# Altium schematic sheet I_DC_Buffering_DIFF.SchDoc
size A4
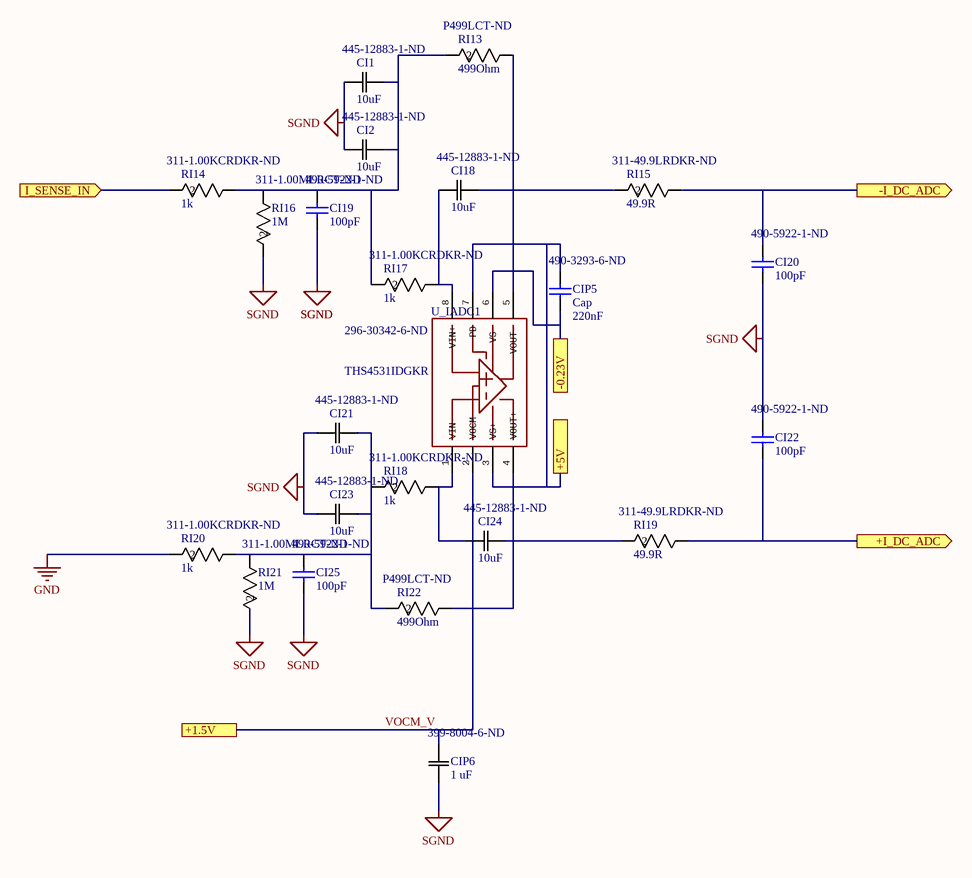
[diagram p0: I_DC_Buffering_DIFF.SchDoc]

## Parts
CI1  10uF  Supplier Part Number 1: 445-12883-1-ND  [CAP_3216]
CI2  10uF  Supplier Part Number 1: 445-12883-1-ND  [CAP_3216]
CI18  10uF  Supplier Part Number 1: 445-12883-1-ND  [CAP_3216]
CI19  Supplier Part Number 1: 490-5922-1-ND  [G-155]  (hidden comment: 100pF)
CI20  Supplier Part Number 1: 490-5922-1-ND  [G-155]  (hidden comment: 100pF)
CI21  10uF  Supplier Part Number 1: 445-12883-1-ND  [CAP_3216]
CI22  Supplier Part Number 1: 490-5922-1-ND  [G-155]  (hidden comment: 100pF)
CI23  10uF  Supplier Part Number 1: 445-12883-1-ND  [CAP_3216]
CI24  10uF  Supplier Part Number 1: 445-12883-1-ND  [CAP_3216]
CI25  Supplier Part Number 1: 490-5922-1-ND  [G-155]  (hidden comment: 100pF)
CIP5  Cap  value 220nF  Supplier Part Number 1: 490-3293-6-ND  [G-188]
CIP6  1 uF  Supplier Part Number 1: 399-8004-6-ND  [CAP_C0805]
RI13  499Ohm  Supplier Part Number 1: P499LCT-ND  [RC0402N]
RI14  1k  Supplier Part Number 1: 311-1.00KCRDKR-ND  [RC0805N]
RI15  49.9R  Supplier Part Number 1: 311-49.9LRDKR-ND  [RC0402N]
RI16  1M  Supplier Part Number 1: 311-1.00MLRCT-ND  [RC0402N]
RI17  1k  Supplier Part Number 1: 311-1.00KCRDKR-ND  [RC0805N]
RI18  1k  Supplier Part Number 1: 311-1.00KCRDKR-ND  [RC0805N]
RI19  49.9R  Supplier Part Number 1: 311-49.9LRDKR-ND  [RC0402N]
RI20  1k  Supplier Part Number 1: 311-1.00KCRDKR-ND  [RC0805N]
RI21  1M  Supplier Part Number 1: 311-1.00MLRCT-ND  [RC0402N]
RI22  499Ohm  Supplier Part Number 1: P499LCT-ND  [RC0402N]
U_IADC1  Supplier Part Number 1: 296-30342-6-ND  [DGK8]  (hidden comment: THS4531IDGKR)

## Ports
+1.5V, +5V, +I_DC_ADC (out), -0.23V, -I_DC_ADC (out), I_SENSE_IN (in)

## Nets
GND: RI20.2
SGND: CI1.1 CI2.1 CI19.1 CI20.1 CI21.1 CI22.2 CI23.1 CI25.1 CIP6.1 RI16.2 RI21.2
+5V: CIP5.2 U_IADC1.3(VS+) U_IADC1.7(PD) ; port +5V
+I_DC_ADC: CI22.1 RI19.1 ; port +I_DC_ADC
-0.23V: CIP5.1 U_IADC1.6(VS-) ; port -0.23V
-I_DC_ADC: CI20.2 RI15.1 ; port -I_DC_ADC
I_SENSE_IN: RI14.2 ; port I_SENSE_IN
VOCM_V: CIP6.2 U_IADC1.2(VOCM) ; port +1.5V
NetCI1_2: CI1.2 CI2.2 CI19.2 RI13.2 RI14.1 RI16.1 RI17.2
NetCI18_1: CI18.1 RI17.1 U_IADC1.8(VIN+)
NetCI18_2: CI18.2 RI13.1 RI15.2 U_IADC1.5(VOUT-)
NetCI21_2: CI21.2 CI23.2 CI25.2 RI18.2 RI20.1 RI21.1 RI22.2
NetCI24_1: CI24.1 RI18.1 U_IADC1.1(VIN-)
NetCI24_2: CI24.2 RI19.2 RI22.1 U_IADC1.4(VOUT+)

## Library data of the parts
CI1 CI2 CI18 CI21 CI23 CI24 = C3216JB1H106K160: No Description Available; Manufacturer_Part_Number: C3216JB1H106K160AB; Manufacturer Part Number: CGA5L3X5R1H106M160AB; Vendor: TDK; Built_By: EMA_UL_Team; Tolerance: 20%; Voltage Rating: 50V; Dielectric: X5R; Copyright: Copyright (C) 2018 Accelerated Designs. All rights reserved; RefDes: RefDes; Type: DEV; Value: Value; Supplier 1: Digi-Key; Manufacturer: TDK; Stock 1: 63212; Pricing 1: 1=0.88, 10=0.673, 100=0.4813, 500=0.3726, 1000=0.32085 (USD); Mount: Surface Mount; Case/Package: 1206; Weight: 0.000571oz; Case Code (Metric): 3216; Case Code (Imperial): 1206; Min Operating Temperature: -55°C; Max Operating Temperature: 85°C; Package Quantity: 2000; Packaging: Tape and Reel; Capacitance: 10uF; Termination: SMD/SMT; Voltage Rating (DC): 50V; Length: 0.126inch; Height: 1.6mm; Width: 0.063inch; Thickness: 0.071inch; Ratings: AEC-Q200; Lead Free: Lead Free; ComponentLink1URL: http://product.tdk.com/en/catalog/datasheets/mlcc_automotive_general_en.pdf?src-supplier=Avnet; ComponentLink1Description: http://product.tdk.com/en/catalog/datasheets/mlcc_automotive_general_en.pdf?src-supplier=Avnet; ComponentLink2URL: https://product.tdk.com/info/en/documents/chara_sheet/CGA5L3X5R1H106M160AB.pdf?src-supplier=Digi-Key; ComponentLink2Description: https://product.tdk.com/info/en/documents/chara_sheet/CGA5L3X5R1H106M160AB.pdf?src-supplier=Digi-Key; ComponentLink3URL: http://www.mouser.com/ds/2/400/lcc_automotive_general_en-843974.pdf?src-supplier=Mouser; ComponentLink3Description: http://www.mouser.com/ds/2/400/lcc_automotive_general_en-843974.pdf?src-supplier=Mouser
CI19 CI20 CI22 CI25 = 1004001100017: CAP,100PF,+/-5%,C0G,50V,SMD0402; Manufacturer: MURATA; Manufacturer Part Number: GRM1555C1H101JA01D; Rating: 5%; Embest PN: 1004001100017; Value: 100pF; Part Type: Ceramic Capacitor; Supplier 1: Digi-Key; Stock 1: 6730695; Pricing 1: 1=0.1, 10=0.035, 100=0.0157, 500=0.01124, 1000=0.00883, 2500=0.00802, 5000=0.00738 (USD); Mount: Surface Mount; Case/Package: 0402; Case Code (Metric): 1005; Case Code (Imperial): 0402; Material: Ceramic; Min Operating Temperature: -55°C; Max Operating Temperature: 125°C; Capacitance: 100pF; Dielectric: C0G; Tolerance: 5%; Voltage Rating: 50V; Packaging: Tape and Reel; Package Quantity: 1; Voltage Rating (DC): 50V; Termination: SMD/SMT; Voltage: 50V; Length: 1mm; Height: 0.5mm; Width: 0.02inch; Thickness: 0.022inch; Depth: 0.5mm; Radiation Hardening: No; REACH SVHC: No SVHC; Lead Free: Lead Free; ComponentLink1URL: http://uk.rs-online.com/webdocs/1423/0900766b81423dc4.pdf?src-supplier=RSComponents; ComponentLink1Description: http://uk.rs-online.com/webdocs/1423/0900766b81423dc4.pdf?src-supplier=RSComponents; ComponentLink2URL: http://psearch.murata.com/capacitor/product/GRM1555C1H101JA01%23.pdf?src-supplier=Future+Electronics; ComponentLink2Description: http://psearch.murata.com/capacitor/product/GRM1555C1H101JA01%23.pdf?src-supplier=Future+Electronics; ComponentLink3URL: https://www.murata.com/~/media/webrenewal/support/library/catalog/products/capacitor/mlcc/c02e.ashx?la=en-us&src-supplier=Digi-Key; ComponentLink3Description: https://www.murata.com/~/media/webrenewal/support/library/catalog/products/capacitor/mlcc/c02e.ashx?la=en-us&src-supplier=Digi-Key; ComponentLink4URL: https://www.verical.com/server-webapp/html/getDatasheet?partID=199957&src-supplier=Verical; ComponentLink4Description: https://www.verical.com/server-webapp/html/getDatasheet?partID=199957&src-supplier=Verical; ComponentLink5URL: https://produktinfo.conrad.com/datenblaetter/450000-474999/453557-da-01-en-VS_KONDENSATOR_0402.pdf?src-supplier=Conrad; ComponentLink5Description: https://produktinfo.conrad.com/datenblaetter/450000-474999/453557-da-01-en-VS_KONDENSATOR_0402.pdf?src-supplier=Conrad
CIP5 = Cap: Capacitor; Manufacturer: Murata; Manufacturer Part Number: GRM188R71C224KA01D; Tolerance: 10%; Voltage Rating: 16V; Dielectric: X7R; Published: 8-Jun-2000; LatestRevisionDate: 17-Jul-2002; LatestRevisionNote: Re-released for DXP Platform.; PackageReference: RAD-0.3; Publisher: Altium Limited; PackageDescription: Radial Cap, Thru-Hole; 2 Leads; 0.3 in Pin Spacing; Supplier 1: Digi-Key; Stock 1: 363677; Pricing 1: 1=0.17, 10=0.116, 100=0.0586, 500=0.04006, 1000=0.03544 (USD); Mount: Surface Mount; Case/Package: 0603; Number of Pins: 2; Case Code (Metric): 1608; Case Code (Imperial): 0603; Min Operating Temperature: -55°C; Max Operating Temperature: 125°C; Packaging: Tape and Reel; Capacitance: 220nF; Package Quantity: 1; Voltage Rating (DC): 16V; Termination: SMD/SMT; Voltage: 16V; Length: 1.6mm; Height: 0.8mm; Width: 0.031inch; Thickness: 0.035inch; Depth: 0.8mm; Radiation Hardening: No; REACH SVHC: No SVHC; Lead Free: Lead Free; ComponentLink1URL: https://www.murata.com/~/media/webrenewal/support/library/catalog/products/capacitor/mlcc/c02e.ashx?la=en-us&src-supplier=Digi-Key; ComponentLink1Description: https://www.murata.com/~/media/webrenewal/support/library/catalog/products/capacitor/mlcc/c02e.ashx?la=en-us&src-supplier=Digi-Key; ComponentLink2URL: http://www.farnell.com/datasheets/608985.pdf?src-supplier=Element14; ComponentLink2Description: http://www.farnell.com/datasheets/608985.pdf?src-supplier=Element14; ComponentLink3URL: http://www.farnell.com/datasheets/2048707.pdf?src-supplier=Element14; ComponentLink3Description: http://www.farnell.com/datasheets/2048707.pdf?src-supplier=Element14; ComponentLink4URL: http://psearch.murata.com/capacitor/product/GRM188R71C223KA01%23.pdf?src-supplier=Future+Electronics; ComponentLink4Description: http://psearch.murata.com/capacitor/product/GRM188R71C223KA01%23.pdf?src-supplier=Future+Electronics; ComponentLink5URL: http://www.farnell.com/datasheets/2048707.pdf?src-supplier=Verical; ComponentLink5Description: http://www.farnell.com/datasheets/2048707.pdf?src-supplier=Verical
CIP6 = C0805C105K3RACTU: No Description Available; Vendor: KEMET; Built_By: EMA_UL_Team; Dielectric Material: Ceramic; Capacitance: 1uF; Tolerance: 10%; Dielectric: X7R; Voltage: 25V; Manufacturer_Part_Number: C0805C105K3RACTU; Copyright: Copyright (C) 2018 Accelerated Designs. All rights reserved; RefDes: RefDes; Type: DEV; Value: Value; Supplier 1: Digi-Key; Manufacturer: KEMET; Manufacturer Part Number: C0805C105K3RACTU; Stock 1: 422784; Pricing 1: 1=0.15, 10=0.105, 100=0.0495, 500=0.03472, 1000=0.02875 (USD); Mount: Surface Mount; Case/Package: 0805; Number of Pins: 2; Contact Plating: Tin,Matte; Case Code (Imperial): 0805; Case Code (Metric): 2012; Min Operating Temperature: -55°C; Max Operating Temperature: 125°C; Packaging: Tape and Reel; Termination: SMD/SMT; Package Quantity: 1; Voltage Rating: 25V; Voltage Rating (DC): 25V; Length: 2mm; Height: 1.25mm; Depth: 1.25mm; Width: 0.049inch; Thickness: 0.055inch; Radiation Hardening: No; REACH SVHC: No SVHC; ComponentLink1URL: http://www.kemet.com/kemet/web/homepage/kechome.nsf/vapubfiles/KEM_C1002_X7R_SMD.pdf/$file/KEM_C1002_X7R_SMD.pdf?src-supplier=Farnell; ComponentLink1Description: http://www.kemet.com/kemet/web/homepage/kechome.nsf/vapubfiles/KEM_C1002_X7R_SMD.pdf/$file/KEM_C1002_X7R_SMD.pdf?src-supplier=Farnell; ComponentLink2URL: http://www.farnell.com/datasheets/1918693.pdf?src-supplier=Element14; ComponentLink2Description: http://www.farnell.com/datasheets/1918693.pdf?src-supplier=Element14; ComponentLink3URL: http://www.farnell.com/datasheets/1851736.pdf?src-supplier=Element14; ComponentLink3Description: http://www.farnell.com/datasheets/1851736.pdf?src-supplier=Element14
RI13 RI22 = ERJ-2RKF4990X: No Description Available; Vendor: Panasonic; Built_By: EMA_UL_Team; Resistance: 499R; Power Rating: 100mW; Tolerance: 1%; Voltage Rating: 50V; Temperature Coefficient: 100ppm/°C; Manufacturer_Part_Number: ERJ-2RKF4990X; Copyright: Copyright (C) 2018 Accelerated Designs. All rights reserved; RefDes: RefDes; Type: DEV; Value: Value; Supplier 1: Digi-Key; Manufacturer: Panasonic; Manufacturer Part Number: ERJ-2RKF4990X; Stock 1: 4505925; Pricing 1: 1=0.1, 10=0.041, 100=0.0167, 1000=0.00751, 2500=0.00652, 5000=0.00538 (USD); Mount: Surface Mount; Case/Package: 0402; Case Code (Metric): 1005; Case Code (Imperial): 0402; Contact Plating: Tin; Min Operating Temperature: -55°C; Max Operating Temperature: 155°C; Packaging: Tape and Reel; Package Quantity: 1; Composition: Thick Film; Number of Terminations: 2; Termination: SMD/SMT; Military Standard: Not; Max Power Dissipation: 100mW; Voltage Rating (DC): 50V; Features: Automotive AEC-Q200; Length: 1mm; Height: 0.35mm; Width: 0.02inch; Depth: 0.5mm; REACH SVHC: No SVHC; Lead Free: Lead Free; ComponentLink1URL: http://industrial.panasonic.com/www-data/pdf/AOA0000/AOA0000CE2.pdf?src-supplier=Avnet; ComponentLink1Description: http://industrial.panasonic.com/www-data/pdf/AOA0000/AOA0000CE2.pdf?src-supplier=Avnet; ComponentLink2URL: http://www.farnell.com/datasheets/1678782.pdf?src-supplier=Element14; ComponentLink2Description: http://www.farnell.com/datasheets/1678782.pdf?src-supplier=Element14; ComponentLink3URL: http://www.farnell.com/datasheets/1911175.pdf?src-supplier=Farnell; ComponentLink3Description: http://www.farnell.com/datasheets/1911175.pdf?src-supplier=Farnell; ComponentLink4URL: http://industrial.panasonic.com/www-data/pdf/AOA0000/AOA0000CE2.pdf?src-supplier=Future+Electronics; ComponentLink4Description: http://industrial.panasonic.com/www-data/pdf/AOA0000/AOA0000CE2.pdf?src-supplier=Future+Electronics; ComponentLink5URL: https://www.alliedelec.com/m/d/623f45ff1957d936ff56d46fd1c28cac.pdf?src-supplier=Allied+Electronics; ComponentLink5Description: https://www.alliedelec.com/m/d/623f45ff1957d936ff56d46fd1c28cac.pdf?src-supplier=Allied+Electronics; ComponentLink6URL: http://www.farnell.com/datasheets/426256.pdf?src-supplier=Element14; ComponentLink6Description: http://www.farnell.com/datasheets/426256.pdf?src-supplier=Element14
RI14 RI17 RI18 RI20 = RC0805FR-071KL: No Description Available; Vendor: Yageo; Built_By: EMA_UL_Team; Tolerance: 1%; Resistance: 1kR; Temperature Coefficient: 100ppm/°C; Voltage Rating (DC): 150V; Power Rating: 125mW; Manufacturer_Part_Number: RC0805FR-071KL; Copyright: Copyright (C) 2018 Accelerated Designs. All rights reserved; RefDes: RefDes; Type: DEV; Value: Value; Supplier 1: Digi-Key; Manufacturer: Yageo; Manufacturer Part Number: RC0805FR-071KL; Stock 1: 25065297; Pricing 1: 1=0.1, 10=0.04, 100=0.0163, 1000=0.00731, 2500=0.00635 (USD); Case/Package: 0805; Number of Pins: 2; Case Code (Metric): 2012; Case Code (Imperial): 0805; Min Operating Temperature: -55°C; Max Operating Temperature: 155°C; Packaging: Tape and Reel; Composition: Thick Film; Package Quantity: 1; Voltage Rating: 150V; Number of Terminations: 2; Termination: SMD/SMT; Military Standard: Not; Max Power Dissipation: 125mW; Features: Moisture Resistant; Length: 0.079inch; Height: 0.024inch; Width: 0.049inch; Depth: 1.25mm; REACH SVHC: Unknown; Lead Free: Lead Free; ComponentLink1URL: http://www.yageo.com/documents/recent/PYu-RC_Group_51_RoHS_L_10.pdf?src-supplier=Digi-Key; ComponentLink1Description: http://www.yageo.com/documents/recent/PYu-RC_Group_51_RoHS_L_10.pdf?src-supplier=Digi-Key; ComponentLink2URL: http://www.farnell.com/datasheets/1686128.pdf?src-supplier=Element14; ComponentLink2Description: http://www.farnell.com/datasheets/1686128.pdf?src-supplier=Element14; ComponentLink3URL: http://www.yageo.ru/pdf/RC0805.pdf?src-supplier=Future+Electronics; ComponentLink3Description: http://www.yageo.ru/pdf/RC0805.pdf?src-supplier=Future+Electronics; ComponentLink4URL: http://www.farnell.com/datasheets/2167052.pdf?src-supplier=Element14; ComponentLink4Description: http://www.farnell.com/datasheets/2167052.pdf?src-supplier=Element14
RI15 RI19 = RC0402FR-0749R9L: No Description Available; Vendor: Yageo; Built_By: EMA_UL_Team; Tolerance: 1%; Power Rating: 62.5mW; Voltage Rating: 50V; Temperature Coefficient: 100ppm/°C; Max Power Dissipation: 63mW; Manufacturer_Part_Number: RC0402FR-0749R9L; Copyright: Copyright (C) 2018 Accelerated Designs. All rights reserved; RefDes: RefDes; Type: DEV; Value: Value; Supplier 1: Digi-Key; Manufacturer: Yageo; Manufacturer Part Number: RC0402FR-0749R9L; Stock 1: 14198932; Pricing 1: 1=0.1, 10=0.016, 100=0.0064, 1000=0.00289, 2500=0.00251, 5000=0.00207 (USD); Case/Package: 0402; Number of Pins: 2; Case Code (Imperial): 0402; Case Code (Metric): 1005; Min Operating Temperature: -55°C; Max Operating Temperature: 155°C; Packaging: Tape and Reel; Resistance: 49.9R; Package Quantity: 1; Termination: SMD/SMT; Composition: Thick Film; Number of Terminations: 2; Military Standard: Not; Voltage Rating (DC): 50V; Working Voltage: 50V; Features: Moisture Resistant; Length: 1mm; Height: 0.016inch; Width: 0.5mm; Depth: 0.5mm; REACH SVHC: No SVHC; Lead Free: Lead Free; ComponentLink1URL: http://documents.rs-components.com/techlib://itc_doclist_GB.htm?stockno=6184536&src-supplier=RSComponents; ComponentLink1Description: http://documents.rs-components.com/techlib://itc_doclist_GB.htm?stockno=6184536&src-supplier=RSComponents; ComponentLink2URL: http://www.farnell.com/datasheets/2167052.pdf?src-supplier=Element14; ComponentLink2Description: http://www.farnell.com/datasheets/2167052.pdf?src-supplier=Element14; ComponentLink3URL: http://www.yageo.com/documents/recent/PYu-RC0402_51_RoHS_L_6_r.pdf?src-supplier=Future+Electronics; ComponentLink3Description: http://www.yageo.com/documents/recent/PYu-RC0402_51_RoHS_L_6_r.pdf?src-supplier=Future+Electronics; ComponentLink4URL: http://www.yageo.com/documents/recent/PYu-RC_Group_51_RoHS_L_10.pdf?src-supplier=Digi-Key; ComponentLink4Description: http://www.yageo.com/documents/recent/PYu-RC_Group_51_RoHS_L_10.pdf?src-supplier=Digi-Key
RI16 RI21 = RC0402FR-071ML: No Description Available; Vendor: Yageo; Built_By: EMA_UL_Team; Resistance: 1MR; Tolerance: 1%; Power Rating: 63mW; Voltage Rating: 50V; Temperature Coefficient: 100ppm/°C; Manufacturer_Part_Number: RC0402FR-071ML; Copyright: Copyright (C) 2018 Accelerated Designs. All rights reserved; RefDes: RefDes; Type: DEV; Value: Value; Supplier 1: Digi-Key; Manufacturer: Yageo; Manufacturer Part Number: RC0402FR-071ML; Stock 1: 10668464; Pricing 1: 1=0.1, 10=0.016, 100=0.0064, 1000=0.00289, 2500=0.00251, 5000=0.00207 (USD); Case/Package: 0402; Case Code (Imperial): 0402; Case Code (Metric): 1005; Min Operating Temperature: -55°C; Max Operating Temperature: 155°C; Composition: Thick Film; Packaging: Tape and Reel; Termination: SMD/SMT; Military Standard: Not; Length: 1mm; Height: 0.32mm; Depth: 0.5mm; REACH SVHC: Unknown; Lead Free: Lead Free; ComponentLink1URL: http://www.farnell.com/datasheets/1018594.pdf?src-supplier=Element14; ComponentLink1Description: http://www.farnell.com/datasheets/1018594.pdf?src-supplier=Element14; ComponentLink2URL: http://www.yageo.com/documents/recent/PYu-RC0402_51_RoHS_L_6_r.pdf?src-supplier=Future+Electronics; ComponentLink2Description: http://www.yageo.com/documents/recent/PYu-RC0402_51_RoHS_L_6_r.pdf?src-supplier=Future+Electronics; ComponentLink3URL: http://www.farnell.com/datasheets/2167052.pdf?src-supplier=Element14; ComponentLink3Description: http://www.farnell.com/datasheets/2167052.pdf?src-supplier=Element14
U_IADC1 = 1002007100055C: IC OPAMP DIFF 27MHZ RRO 8VSSOP TR; Manufacturer: TI; Max Input Voltage: 5.5V; Min Input Voltage: 2.5V; Common Mode Rejection Ratio: 90dB; Bandwidth: 36MHz; Nominal Supply Current: 250uA; Output Current: 50mA; Voltage Gain: 114dB; Number of Channels: 1; Slew Rate: 15V/µs; Max I/O Voltage: 1mV; Output Current per Channel: 25mA; Input Bias Current: 160nA; Power Supply Rejection Ratio (PSRR): 108dB; Settling Time: 60ns; Input Offset Voltage (Vos): 200uV; Embest PN: 1002007100055C; Value: THS4531IDGKR; Part Type: Amplifier; Manufacturer Part Number: THS4531IDGKR; Supplier 1: Digi-Key; Stock 1: 3654; Pricing 1: 1=2.94, 10=2.642, 25=2.4928, 100=1.9941, 250=1.74484, 500=1.69496, 1000=1.346 (USD); Case/Package: VSSOP; Number of Pins: 8; Min Operating Temperature: -40°C; Max Operating Temperature: 125°C; Packaging: Tape and Reel; Package Quantity: 1; Unity Gain Bandwidth Product: 27MHz; -3db Bandwidth: 36MHz; Max Supply Voltage: 5.5V; Min Supply Voltage: 2.5V; Operating Supply Current: 250uA; Number of Circuits: 1; Gain Bandwidth Product: 27MHz; Number of Elements: 1; Radiation Hardening: No; Lead Free: Lead Free; ComponentLink1URL: http://www.ti.com/lit/ds/symlink/ths4531.pdf?src-supplier=Digi-Key; ComponentLink1Description: http://www.ti.com/lit/ds/symlink/ths4531.pdf?src-supplier=Digi-Key; ComponentLink2URL: http://www.ti.com/lit/ds/symlink/ths4531.pdf?src-supplier=Avnet; ComponentLink2Description: http://www.ti.com/lit/ds/symlink/ths4531.pdf?src-supplier=Avnet